# EAGLE design mapleCUx_large_340-007 (EAGLE 9.1.0)
MAPLE-CUx Large Version
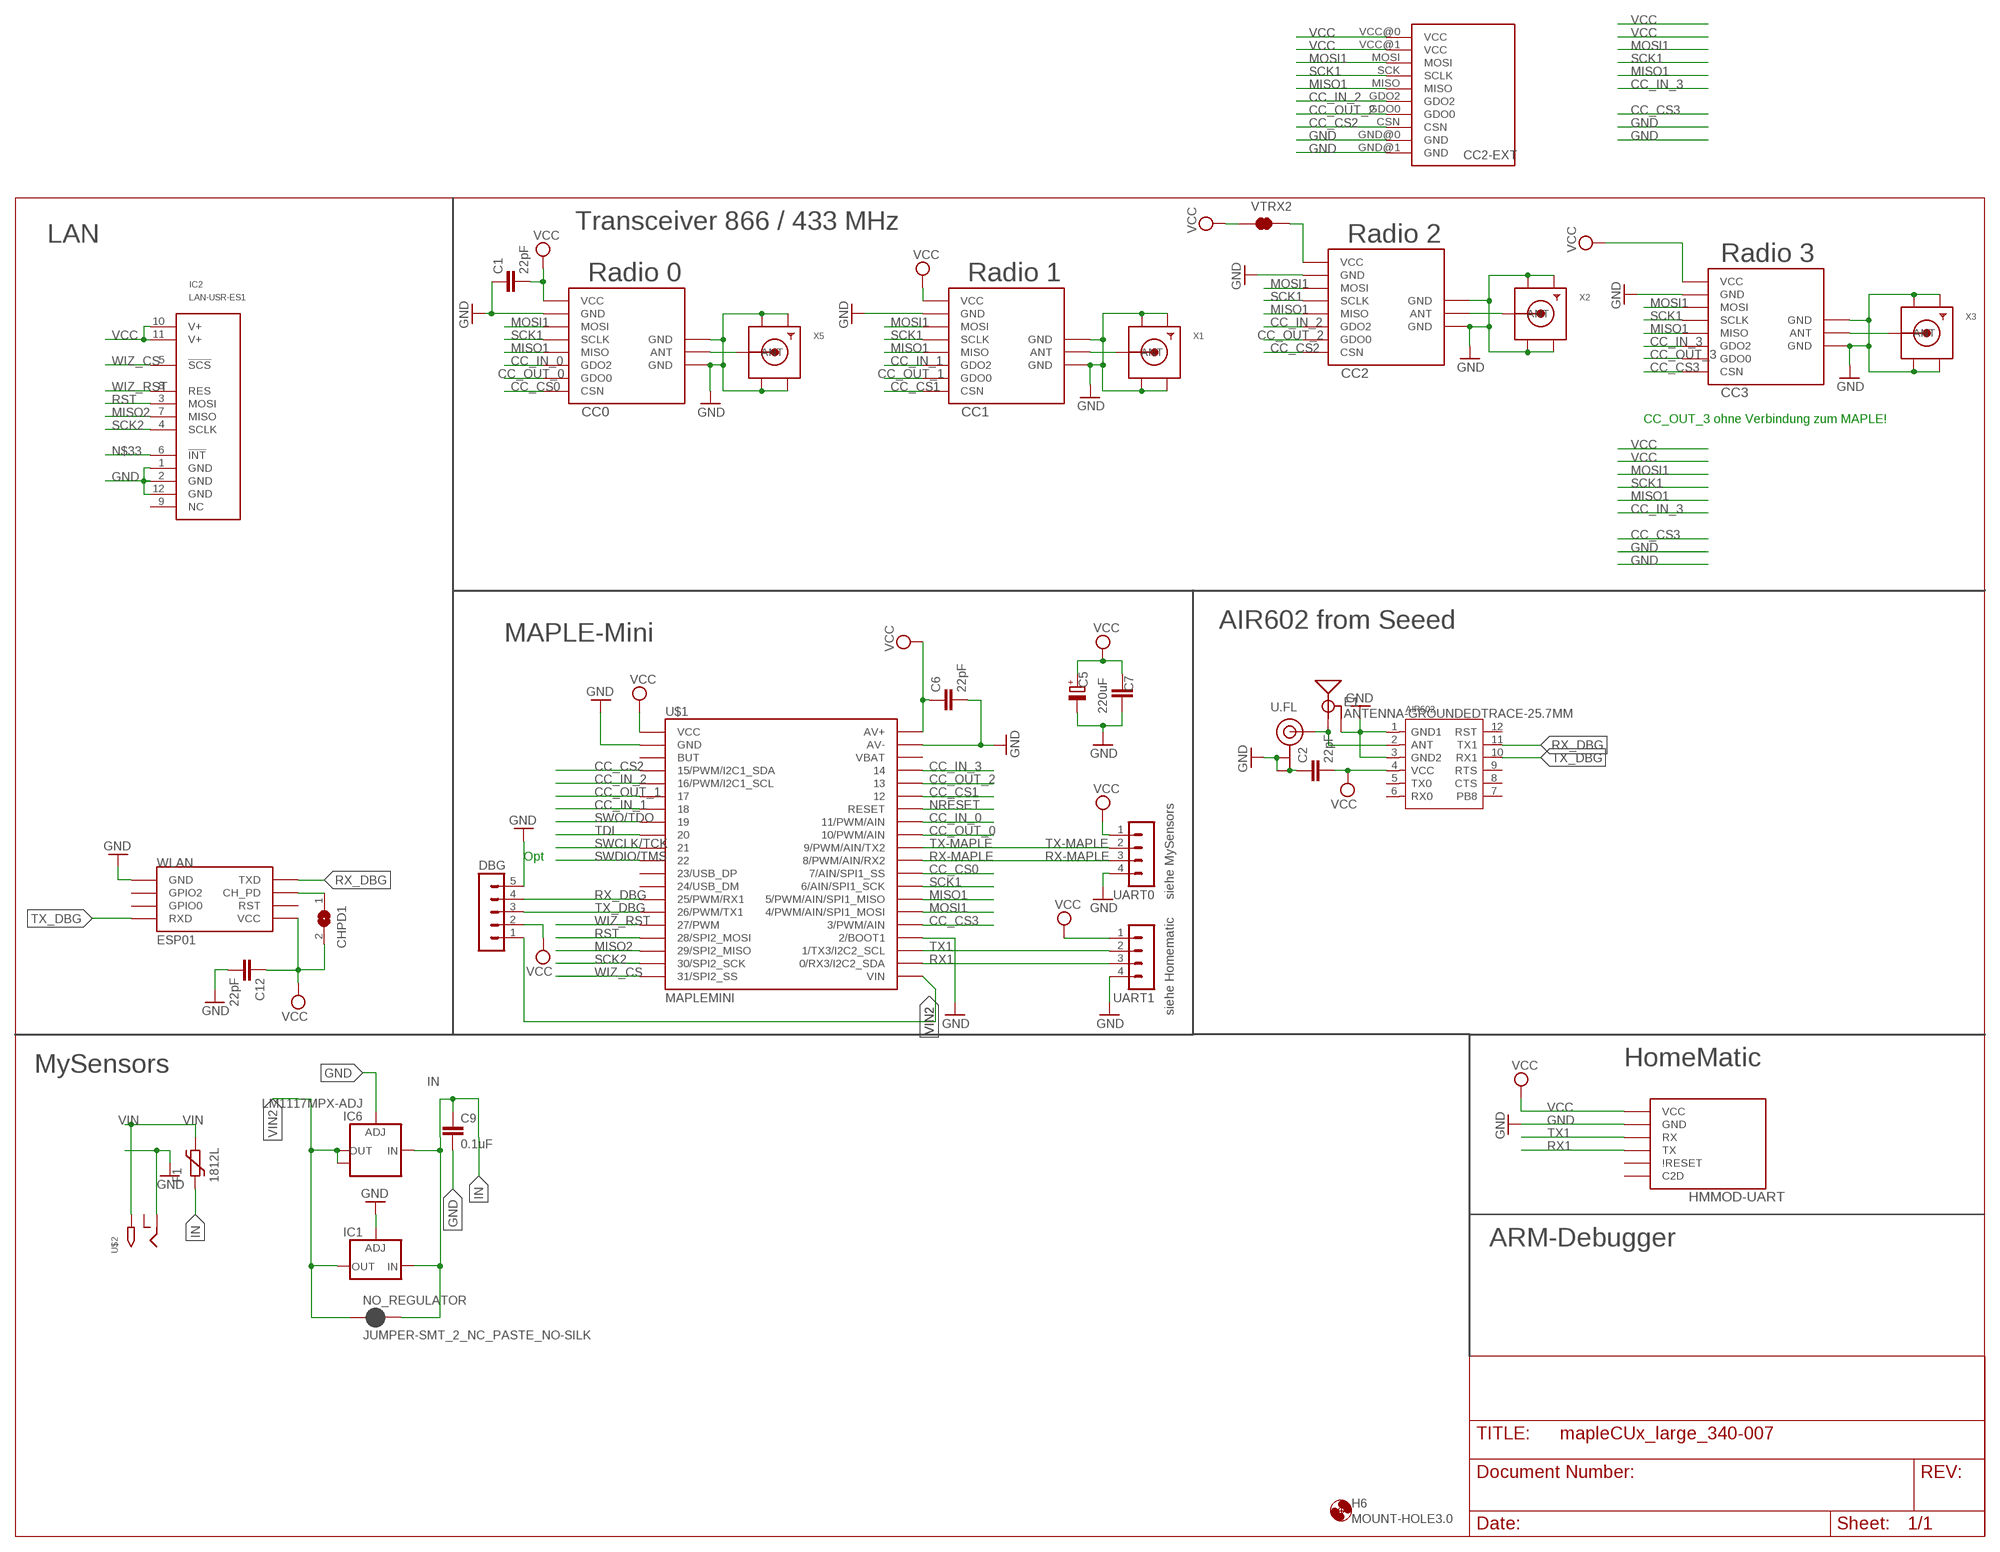
[diagram p0: schematic, sheet 1]

## Parts
AIR602  AIR602  [MODULE12P-2.0-10X12MM]
C1  22pF  C-EUC0805  [C0805]
C2  22pF  C-EUC0805  [C0805]
C5  220uF  CPOL-EUE5-8.5  [E5-8,5]
C6  22pF  C-EUC0805  [C0805]
C7  C-EUC1812  [C1812]
C9  0.1uF  C-EUC1206  [C1206]
C12  22pF  C-EUC0805  [C0805]
CC0  CC1101  CC1101_MODULE1SMD  [CC1101_MODULE1_SMD]
CC1  CC1101_MODULE1SMD  [CC1101_MODULE1_SMD]
CC2  CC1101_MODULE1SMD  [CC1101_MODULE1_SMD]
CC2-EXT  CC1101_MODULE3_DIL  [CC1101_MODULE3_DIL]
CC3  CC1101_MODULE1SMD  [CC1101_MODULE1_SMD]
CHPD1  SJ  [SJ]
DBG  MA05-1  [MA05-1]
E1  ANTENNA-GROUNDEDTRACE-25.7MM  [TRACE_ANTENNA_2.4GHZ_25.7MM]
F1  1812L  [1812L]
H6  MOUNT-HOLE3.0  [3,0]
HMMOD-UART  HM-MOD-UARTDIL  [HM-MOD-UART-DIL]
IC1  LD117ADT50TR  [DPACK]
IC2  LAN-USR-ES1  [USR-ES1]
IC6  LM1117MPX-ADJ  [SOT223]
NO_REGULATOR  JUMPER-SMT_2_NC_PASTE_NO-SILK  [SMT-JUMPER_2_NC_PASTE_NO-SILK]
U$1  MAPLEMINI  [20-DIP]
U$2  2.1MMJACKTHM  [PJ-102A]
U.FL  U.FL  [U.FL]
UART0  MA04-1  [MA04-1]
UART1  MA04-1  [MA04-1]
VTRX2  JUMPER-SMT_2_NC_TRACE_SILK  [SMT-JUMPER_2_NC_TRACE_SILK]
WLAN  ESP01  [ESP01]
X1  SMACONNECTOR_EDGE  [SMA_EDGELAUNCH]
X2  SMACONNECTOR_EDGE  [SMA_EDGELAUNCH]
X3  SMACONNECTOR_EDGE  [SMA_EDGELAUNCH]
X5  SMACONNECTOR_EDGE  [SMA_EDGELAUNCH]

## Nets
ANT0: CC0.ANT X5.P(ANT)
ANT1: CC1.ANT X1.P(ANT)
ANT2: CC2.ANT X2.P(ANT)
ANT3: CC3.ANT X3.P(ANT)
CC_CS0: CC0.CSN U$1.29(7/AIN/SPI1_SS)
CC_CS1: CC1.CSN U$1.35
CC_CS2: CC2-EXT.CSN CC2.CSN U$1.4(15/PWM/I2C1_SDA)
CC_CS3: CC3.CSN U$1.25(3/PWM/AIN)
CC_IN_0: CC0.GDO2 U$1.33(11/PWM/AIN)
CC_IN_1: CC1.GDO2 U$1.7
CC_IN_2: CC2-EXT.GDO2 CC2.GDO2 U$1.5(16/PWM/I2C1_SCL)
CC_IN_3: CC3.GDO2 U$1.37
CC_OUT_0: CC0.GDO0 U$1.32(10/PWM/AIN)
CC_OUT_1: CC1.GDO0 U$1.6
CC_OUT_2: CC2-EXT.GDO0 CC2.GDO0 U$1.36
CC_OUT_3: CC3.GDO0
GND [Power]: AIR602.1(GND1) AIR602.3(GND2) C1.1 C5.- C6.2 C7.1 C9.2 C12.2 CC0.GND@0(GND) CC0.GND@1(GND) CC0.GND@2(GND) CC1.GND@0(GND) CC1.GND@1(GND) CC1.GND@2(GND) CC2-EXT.GND@0(GND) CC2-EXT.GND@1(GND) CC2.GND@0(GND) CC2.GND@1(GND) CC2.GND@2(GND) CC3.GND@0(GND) CC3.GND@1(GND) CC3.GND@2(GND) DBG.5 E1.GND E1.GND2(GND) HMMOD-UART.2(GND) IC1.1(ADJ) IC2.1(GND) IC2.2(GND) IC2.12(GND) IC6.1(ADJ) U$1.2(GND) U$1.24(2/BOOT1) U$1.39(AV-) U$2.RING U.FL.1(GND) U.FL.2(GND) UART0.4 UART1.4 WLAN.GND X1.GND@1(GND4) X1.GND@2(GND3) X1.GND@3(GND2) X1.GND@4(GND1) X2.GND@1(GND4) X2.GND@2(GND3) X2.GND@3(GND2) X2.GND@4(GND1) X3.GND@1(GND4) X3.GND@2(GND3) X3.GND@3(GND2) X3.GND@4(GND1) X5.GND@1(GND4) X5.GND@2(GND3) X5.GND@3(GND2) X5.GND@4(GND1)
IN [Power]: C9.1 F1.P$1 IC1.3(IN) IC6.3(IN) NO_REGULATOR.2
MISO1: CC0.MISO CC1.MISO CC2-EXT.MISO CC2.MISO CC3.MISO U$1.27(5/PWM/AIN/SPI1_MISO)
MISO2: IC2.7(MISO) U$1.18(29/SPI2_MISO)
MOSI1: CC0.MOSI CC1.MOSI CC2-EXT.MOSI CC2.MOSI CC3.MOSI U$1.26(4/PWM/AIN/SPI1_MOSI)
N$1 [Power]: CC2.VCC VTRX2.2
N$2: CHPD1.1 WLAN.CH_PD
N$3: C2.1
N$4: AIR602.2(ANT) E1.ANT(SIGNAL) U.FL.FEED(SIGNAL)
N$33: IC2.6(!INT!)
NRESET: U$1.34(RESET)
RST: IC2.3(MOSI) U$1.17(28/SPI2_MOSI)
RX1: HMMOD-UART.5(TX) U$1.22(0/RX3/I2C2_SDA) UART1.3
RX-MAPLE: U$1.30(8/PWM/AIN/RX2) UART0.3
RX_DBG: AIR602.11(TX1) DBG.4 U$1.14(25/PWM/RX1) WLAN.TX(TXD)
SCK1: CC0.SCLK CC1.SCLK CC2-EXT.SCK(SCLK) CC2.SCLK CC3.SCLK U$1.28(6/AIN/SPI1_SCK)
SCK2: IC2.4(SCLK) U$1.19(30/SPI2_SCK)
SWCLK/TCK: U$1.10
SWDIO/TMS: U$1.11
SWO/TDO: U$1.8
TDI: U$1.9
TX1: HMMOD-UART.6(RX) U$1.23(1/TX3/I2C2_SCL) UART1.2
TX-MAPLE: U$1.31(9/PWM/AIN/TX2) UART0.2
TX_DBG: AIR602.10(RX1) DBG.3 U$1.15(26/PWM/TX1) WLAN.RX(RXD)
VCC [Power]: AIR602.4(VCC) C1.2 C2.2 C5.+ C6.1 C7.2 C12.1 CC0.VCC CC1.VCC CC2-EXT.VCC@0(VCC) CC2-EXT.VCC@1(VCC) CC3.VCC CHPD1.2 DBG.2 HMMOD-UART.1(VCC) IC2.10(V+) IC2.11(V+) U$1.1(VCC) U$1.40(AV+) UART0.1 UART1.1 VTRX2.1 WLAN.VCC
VIN [Power]: F1.P$2 U$2.TIP
VIN2 [Power]: DBG.1 IC1.4(OUT) IC6.2(OUT) IC6.TAB(OUT1) NO_REGULATOR.1 U$1.21(VIN)
WIZ_CS: IC2.5(!SCS!) U$1.20(31/SPI2_SS)
WIZ_RST: IC2.8(RES) U$1.16(27/PWM)
Unconnected: AIR602.5(TX0) AIR602.6(RX0) AIR602.7(PB8) AIR602.8(CTS) AIR602.9(RTS) AIR602.12(RST) HMMOD-UART.3(C2D) HMMOD-UART.4(\!RESET) IC2.9(NC) U$1.3(BUT) U$1.12(23/USB_DP) U$1.13(24/USB_DM) U$1.38(VBAT) U$2.RING_SW WLAN.GPIO0 WLAN.GPIO2 WLAN.RST

## Notes on the sheet
- Transceiver 866 / 433 MHz
- LAN | Radio 2
- Radio 3
- Radio 0 | Radio 1
- CC_OUT_3 ohne Verbindung zum MAPLE!
- AIR602 from Seeed
- MAPLE-Mini
- Opt
- siehe MySensors
- siehe Homematic
- MySensors | HomeMatic
- ARM-Debugger

## Library data of the parts
AIR602 = AIR602:AIR602
C1 C2 C6 C7 C9 C12 = rcl:C-EU: CAPACITOR, European symbol
C5 = rcl:CPOL-EU: POLARIZED CAPACITOR, European symbol
CC0 CC1-CC3 = wireless:CC1101_MODULE1: CC1101 wireless module for 433/868 MHz (sold from Aliexpress). DIL version for mounting with pin header (and SMD soldering) and SMD only variant available.
CC2-EXT = wireless:CC1101_MODULE3_DIL: 433 Mhz CC1101 wireless module named RF1101SE V3.1 package special has only limited silk screen on tPlace layer
CHPD1 = jumper:SJ: SMD solder JUMPER
DBG = con-lstb:MA05-1: PIN HEADER; OC_FARNELL: unknown; OC_NEWARK: unknown
E1 = SparkFun-RF:ANTENNA-GROUNDED: Antenna w/ Ground Connection 2.4GHz antennae with signal and ground terminals. TRACE_ANTENNA_2.4GHZ_15.2MM - Meander Trace antenna 15.2 x 5.7mm footprint Based on layout from TI app note AN043 <http://www.ti.com/lit/an/swra117d/swra117d.pdf>. TRACE_ANTENNA_2.4GHZ_25.7MM - Inverted F trace antenna 25.7 x 7.5 mm footprint. Based on layout from TI design note DN0007 <http://www.ti.com/lit/an/swru120b/swru120b.pdf>.
F1 = ptc-littlefuse:1812L
H6 = holes:MOUNT-HOLE: MOUNTING HOLE with drill center marker
HMMOD-UART = wireless:HM-MOD-UART: eQ3 HM-MOD-UART-AW-SH2 wireless module for 868 MHz. DIL version for mounting with pin header (antenna upwards) and SMD variant available (antenna downwards).
IC1 = v-reg:LD117A?*: Low drop fixed and adjustable positive voltage regulators 1 A Source: http://www.st.com/stonline/products/literature/ds/7194/ld1117axx.pdf
IC2 = Martin-Communication:LAN-USR-ES1
IC6 = lm1117:LM1117MPX-ADJ
NO_REGULATOR = SparkFun-Jumpers:JUMPER-SMT_2_NC_PASTE: Normally closed solder jumper This jumper has an aperture in the stencil to allow solder paste to bridge the split in the wire so it's normally closed (NC). Wick off the solder to open the connection. Reapply solder to reclose the connection.
U$1 = maplemini-small:MAPLEMINI
U$2 = adafruit:2.1MMJACK: 2.1mm x 5.5mm THM DC jack with internal switch. Digikey part #PJ-102A, 4UCON part #05537 2.1mm x 5.5mm SMT DC jack with internal switch. Digikey part #PJ-002A-SMT, 4UCON part #03267 By microbuilder.eu & adafruit.com
U.FL = SparkFun-Connectors:U.FL: SMD Antenna Connector - U.FL 2mm height, 3.0mm x 3.0mm receptacle size. SparkFun Products: SparkFun WiFi Shield - ESP8266 <https://www.sparkfun.com/products/13287> SparkFun ESP8266 Thing <https://www.sparkfun.com/products/13231> SparkFun MiniGen - Pro Mini Signal Generator Shield <https://www.sparkfun.com/products/11420>; PROD_ID: CONN-09193; SF_ID: WRL-09144
UART0 UART1 = con-lstb:MA04-1: PIN HEADER; OC_FARNELL: unknown; OC_NEWARK: unknown
VTRX2 = SparkFun-Jumpers:JUMPER-SMT_2_NC_TRACE: Normally closed trace jumper This jumper has a trace between two pads so it's normally closed (NC). Use a razor knife to open the connection. For best results follow the IPC guidelines for cutting traces: Cutout at least 0.063 mm (0.005 in). Remove all loose material to clean up the cut area. Seal the cut with an approved epoxy. Reapply solder to reclose the connection.
WLAN = esp8266modules:ESP01: ESP8266 Wifi module 01
X1-X3 X5 = adafruit:SMACONNECTOR: SMA Connector 90° DIP SMA Connector, 50 Ohm (4UConnector: 07259)

## Net classes
0 default: width 0.305 mm
1 Power: width 0.61 mm

## Board
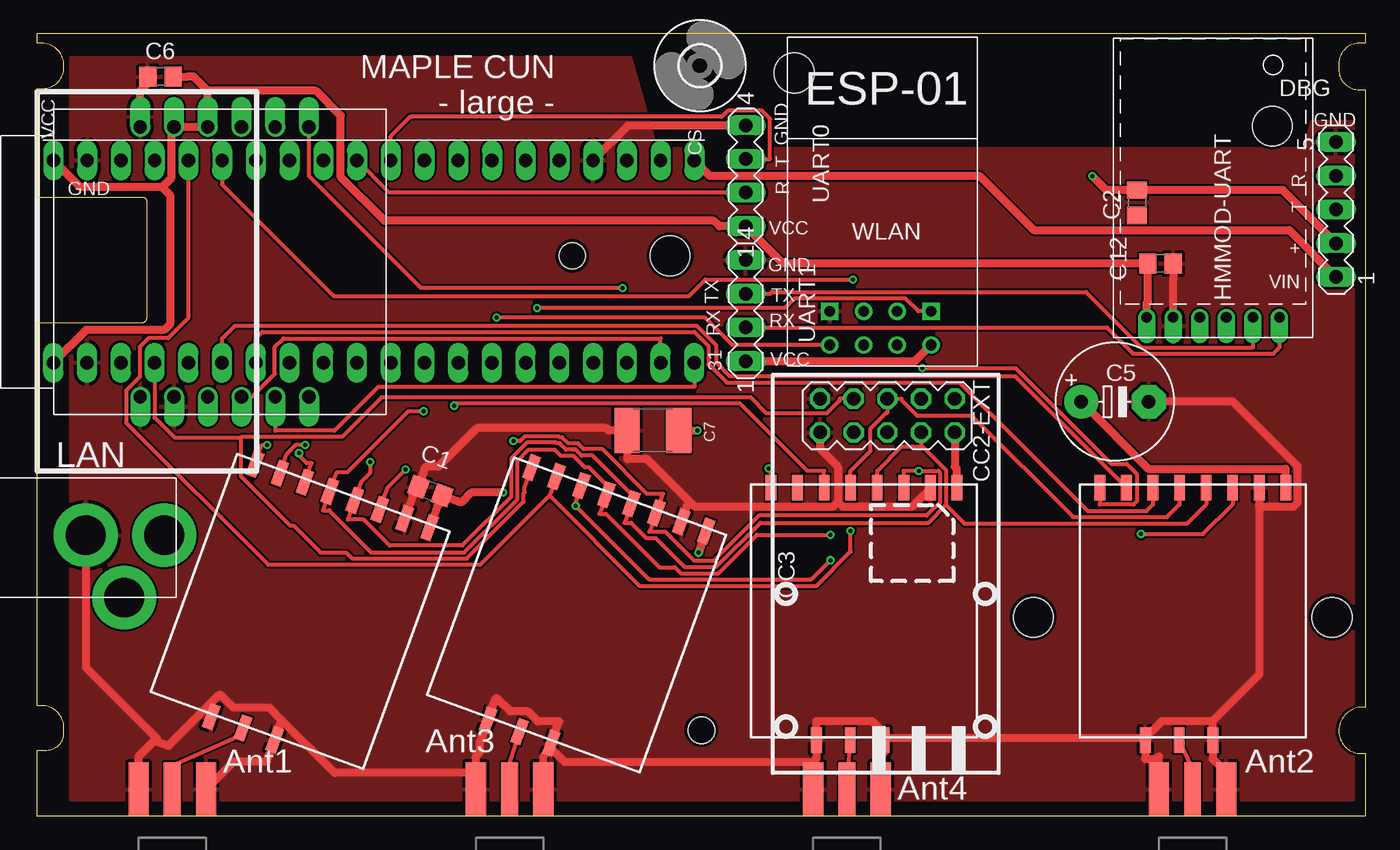
[diagram p1: board, top side]
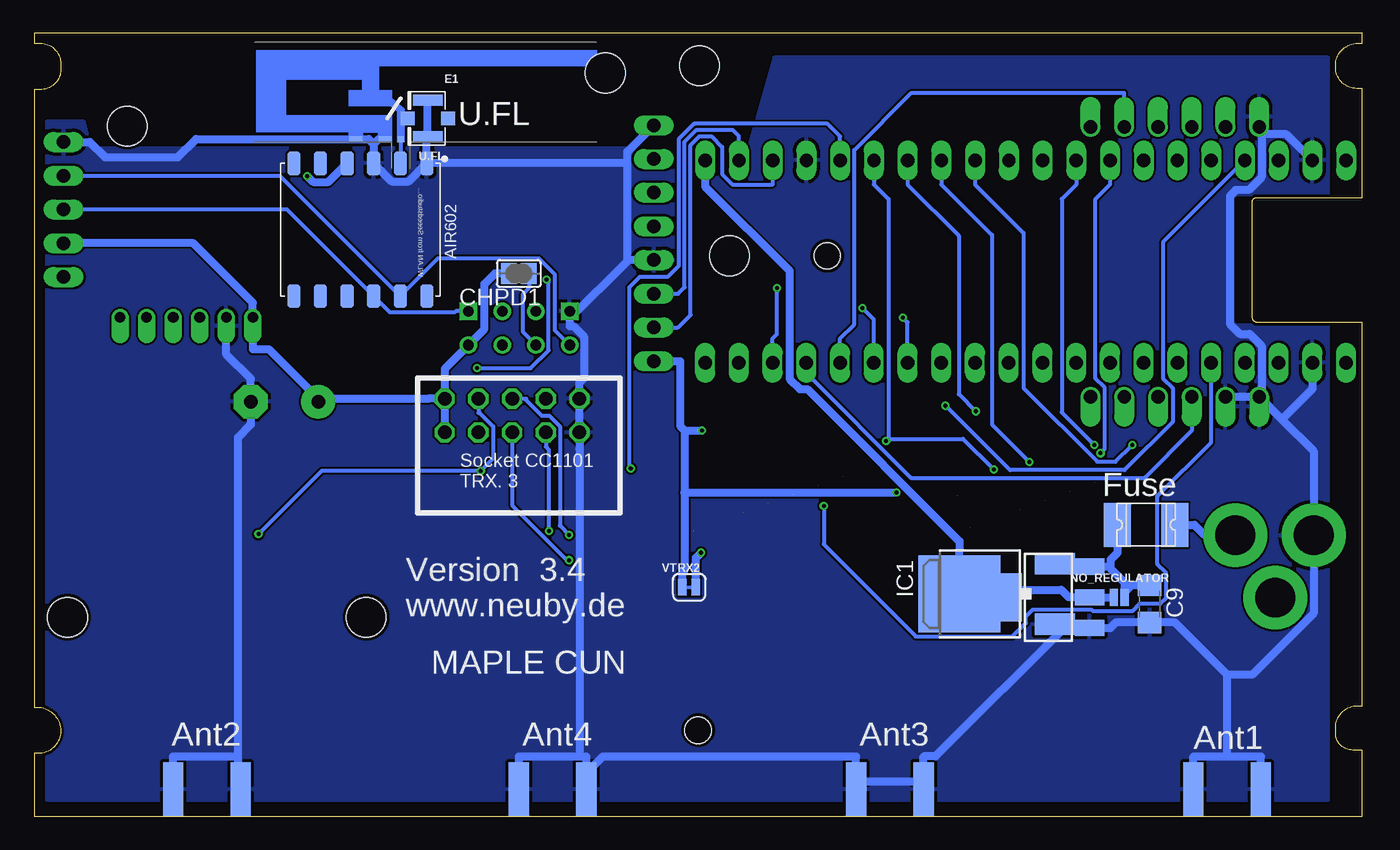
[diagram p2: board, bottom side, seen from below]

Size 100 x 59 mm. Coordinates in mm from the lower left corner, seen from the top.
Outline: 0,0 0,5 0.71,5 arc90 2,6.29 2,6.67 arc90 0.32,8.35 0,8.35 0,37.21 7.89,37.21 arc90 8.26,37.58 8.26,46.32 arc90 7.97,46.61 0,46.61 0,54.83 0.39,54.83 arc90 2,56.44 2,56.57 arc90 0.33,58.24 0,58.24 0,59 100,59 100,58.24 99.54,58.24 arc90 98,56.7 98,56.41 arc90 99.41,54.75 100,54.75 100,8.24 99.8,8.24 arc90 98,6.44 arc90 99.69,4.75 100,4.75 100,0 0,0
Copper layers (1*16): Top 0.035mm / dielectric 1.5mm / Bottom 0.035mm
Design rules "SeeedStudio_2layer_DRU_no_angle_20140221": minimum track width 6mil, minimum drill 12mil, track to track 6mil, track to pad 6mil, pad to pad 6mil, via to via 6mil, smd to smd 0mil, copper to edge 10mil, drill to drill 10mil, minimum pad ring 10mil, minimum via ring 6mil, stop-mask expansion 2mil, vias tented up to drill 100mil, thermal gap 10mil
Holes 2 mm at 50,6.5 40.28,42.23
Holes 3 mm at 47.65,42.23 93,52 57,56 75,15 97.5,15
tRestrict: area 0,37.3 to 9.4,46.5
bRestrict: area 0,37.3 to 9.4,46.5

### Footprints (pad centres in the part's own frame; a part is rotated, then mirrored left to right if it is on the bottom)
MODULE12P-2.0-10X12MM = smd 1.8 x 1: 1 -5,5; 2 -5,3; 3 -5,1; 4 -5,-1; 5 -5,-3; 6 -5,-5; 7 5,-5; 8 5,-3; 9 5,-1; 10 5,1; 11 5,3; 12 5,5
C0805 = smd 1.3 x 1.5: 1 -0.95,0; 2 0.95,0
E5-8,5 = drill 1.016 pad 2.54: + -2.54,0 | drill 1.016 pad 2.54 octagon: - 2.54,0
C1812 = smd 1.9 x 3.4: 1 -1.95,0; 2 1.95,0
C1206 = smd 1.6 x 1.8: 1 -1.4,0; 2 1.4,0
CC1101_MODULE1_SMD = smd 1.93 x 0.813: ANT 19,5.96; CSN 0,0; GDO0 0,2; GDO2 0,4; GND@0 0,12; GND@1 19,8.5; GND@2 19,3.42; MISO 0,6; MOSI 0,10; SCLK 0,8; VCC 0,14
CC1101_MODULE3_DIL = drill 1.016 octagon: CSN 1.81,6.1; GDO0 4.35,6.1; GDO2 4.35,8.64; GND@0 1.81,3.56; GND@1 4.35,3.56; MISO 1.81,8.64; MOSI 1.81,11.18; SCK 4.35,11.18; VCC@0 1.81,13.72; VCC@1 4.35,13.72
SJ = smd 1.168 x 1.6: 1 -0.762,0; 2 0.762,0
MA05-1 = drill 1.016 long: 1 -5.08,0; 2 -2.54,0; 3 0,0; 4 2.54,0; 5 5.08,0
TRACE_ANTENNA_2.4GHZ_25.7MM = smd 0.46 x 0.46: ANT 0,0.23 | smd 1 x 0.46: GND -1.18,0.23; GND2 -3.38,0.23
1812L = smd 2.03 x 3.3: P$1 -2.16,0; P$2 2.16,0
3,0 = hole 3: 0,0
HM-MOD-UART-DIL = drill 0.8 offset: 1 0,12; 2 0,10; 3 0,8; 4 0,6; 5 0,4; 6 0,2
DPACK = smd 1.6 x 3: 1 -2.28,-4.8; 3 2.28,-4.8 | smd 5.8 x 6.2: 4 0,2.38
USR-ES1 = drill 1 pad 1.35 offset: 1 -10.16,5.715; 2 -10.16,3.175; 3 -10.16,0.635; 4 -10.16,-1.905; 5 -10.16,-4.445; 6 -10.16,-6.985; 7 10.16,-6.985; 8 10.16,-4.445; 9 10.16,-1.905; 10 10.16,0.635; 11 10.16,3.175; 12 10.16,5.715
SOT223 = smd 1.219 x 2.235: 1 -2.311,-3.099; 2 0,-3.099; 3 2.311,-3.099 | smd 3.6 x 2.2: TAB 0,3.099
SMT-JUMPER_2_NC_PASTE_NO-SILK = smd 0.635 x 1.27: 1 -0.406,0; 2 0.406,0
20-DIP = drill 1.016 pad 1.27 long: 1 -24.13,-7.62; 2 -21.59,-7.62; 3 -19.05,-7.62; 4 -16.51,-7.62; 5 -13.97,-7.62; 6 -11.43,-7.62; 7 -8.89,-7.62; 8 -6.35,-7.62; 9 -3.81,-7.62; 10 -1.27,-7.62; 11 1.27,-7.62; 12 3.81,-7.62; 13 6.35,-7.62; 14 8.89,-7.62; 15 11.43,-7.62; 16 13.97,-7.62; 17 16.51,-7.62; 18 19.05,-7.62; 19 21.59,-7.62; 20 24.13,-7.62 | drill 1 pad 1.27 long: 21 24.13,7.62; 22 21.59,7.62; 23 19.05,7.62; 24 16.51,7.62; 25 13.97,7.62; 26 11.43,7.62; 27 8.89,7.62; 28 6.35,7.62; 29 3.81,7.62; 30 1.27,7.62; 31 -1.27,7.62; 32 -3.81,7.62; 33 -6.35,7.62; 34 -8.89,7.62; 35 -11.43,7.62; 36 -13.97,7.62; 37 -16.51,7.62; 38 -19.05,7.62; 39 -21.59,7.62; 40 -24.13,7.62
PJ-102A = drill 3 pad 4.8: RING 0.1,-3.39; RING_SW -4.6,-6.29; TIP 0.1,-9.29
U.FL = smd 2.2 x 0.85: 1 0,1.375; 2 0,-1.375 | smd 1.05 x 1: FEED 1.525,0; NC -1.525,0
MA04-1 = drill 1.016 long: 1 -3.81,0; 2 -1.27,0; 3 1.27,0; 4 3.81,0
SMT-JUMPER_2_NC_TRACE_SILK = smd 0.635 x 1.27: 1 -0.508,0; 2 0.508,0
ESP01 = drill 0.8: CH_PD -1.285,-8.178; GPIO0 1.255,-5.638; GPIO2 -1.285,-5.638; RST 1.255,-8.178; TX -3.825,-8.178; VCC 3.795,-8.178 | drill 0.8 square: GND -3.825,-5.638; RX 3.795,-5.638
SMA_EDGELAUNCH = smd 4.064 x 1.524: GND@1 2.032,-2.54; GND@2 2.032,2.54 | smd 4.064 x 1.524 bottom: GND@3 2.032,2.54; GND@4 2.032,-2.54 | smd 4.064 x 1.27: P 2.032,0

### Placement (x,y rotation side)
AIR602  75.44,44.2 270 bottom
C1  29.59,24.51 340 top
C2  82.8,46.23 90 top
C5  81.15,31.24 0 top
C6  9.27,55.74 180 top
C7  46.35,29.08 0 top
C9  16,16 270 bottom
C12  84.58,41.66 0 top
CC0  16.38,26.54 250 top
CC1  80.01,24.77 270 top
CC2  37.21,26.29 250 top
CC2-EXT  55.37,33.27 270 top
CC3  55.24,24.77 270 top
CHPD1  63.5,40.89 180 bottom
DBG  97.79,45.72 90 top
E1  72.39,50.8 0 bottom
F1  16.26,21.97 0 bottom
H6  49.89,56.55 0 top
HMMOD-UART  95.54,37.59 90 top
IC1  27.94,16.76 90 bottom
IC2  13.46,41.78 90 top
IC6  23.62,16.51 90 bottom
NO_REGULATOR  18.29,16.51 0 bottom
U$1  25.34,41.8 0 top
U$2  0.25,21.08 90 top
U.FL  70.36,52.58 180 bottom
UART0  53.34,48.26 90 top
UART1  53.34,38.1 90 top
VTRX2  50.67,17.27 0 bottom
WLAN  63.5,43.69 0 top
X1  87,0 90 top
X2  35.56,0 90 top
X3  60.96,0 90 top
X5  10.16,0 90 top

### Tracks (layer width: path | path; a pad name or v marks a point on that pad's centre or on a via)
ANT0
  Top 0.305: CC0.ANT 14.73,5.84 10.16,3.81 X5.P
ANT1
  Top 0.305: CC1.ANT 86.87,3.81 X1.P
ANT2
  Top 0.305: CC2.ANT 35.31,3.3 X2.P
ANT3
  Top 0.305: CC3.ANT 60.96,2.54 X3.P
CC_CS0  (via drill 0.3 pad 0.61)
  Top 0.305: v17.3,27.99 v17.29,27.98 16.91,27.98 CC0.CSN
  Bottom 0.305: v17.3,27.99 18.56,26.73 19.94,26.73 25.5,32.29 25.5,43.96 29.15,47.61 U$1.29
CC_CS1  (via drill 0.3 pad 0.61)
  Top 0.305: v66.65,33.76 73.66,33.76 80.87,26.56 82.04,26.56 82.78,25.82 82.78,23.73 82.55,23.5 80.01,23.5 CC1.CSN | U$1.35 13.91,47.61 22.31,39.2 49.06,39.2 50.31,40.45 v61.43,40.45
  Bottom 0.305: v66.65,33.76 62.61,33.76 61.26,35.11 61.26,40.28 v61.43,40.45
CC_CS2
  Top 0.305: 15.32,28.53 15.32,25.63 19.05,21.91 19.29,21.91 21.31,19.89 23.25,19.89 23.7,19.43 32.33,19.43 36.62,23.72 36.62,24.37 36.69,24.44 36.69,24.85 | 36.69,24.85 | 15.32,28.53 15.4,28.6 17.56,28.6 17.57,28.59 22.93,28.59 25.91,31.56 53.72,31.56 54.92,30.36 59.44,30.36 60.41,31.33 60.41,31.46 CC2-EXT.CSN | U$1.4 8.83,30.04 10.34,28.53 15.32,28.53 | CC2.CSN 36.69,24.85
CC_CS3  (via drill 0.3 pad 0.61)
  Top 0.305: v55.07,26.21 55.24,26.04 CC3.CSN
  Bottom 0.305: v55.07,26.21 55.2,26.34 55.2,39.84 54.4,40.64 52.31,40.64 51.48,41.47 51.48,51 50.3,52.18 40.25,52.18 39.31,51.23 U$1.25
CC_IN_0  (via drill 0.3 pad 0.61)  (1 unrouted)
  Top 0.305: v19.7,27.36 19.7,27.21 19.75,27.15 20.29,26.61 20.66,26.61 CC0.GDO2
  Bottom 0.305: v19.7,27.36 19.39,27.67 19.39,32.31 20.08,33 20.08,46.52 18.99,47.61 U$1.33
CC_IN_1
  Top 0.305: CC1.GDO2 84.01,23.5 83.52,23.01 79.12,23.01 69.45,32.68 51.93,32.68 50.53,34.08 50.53,35.44 49.48,36.49 16.93,36.49 16.45,36.01 U$1.7
CC_IN_2  (via drill 0.3 pad 0.61)  (1 unrouted)
  Top 0.305: v59.72,19.3 58.27,17.86 46.07,17.86 v40.54,23.39 40.45,23.48 | 40.45,23.48 | CC2.GDO2 40.45,23.48
  Bottom 0.305: v59.72,19.3 59.88,19.3 64.01,23.43 64.01,27.86 CC2-EXT.GDO2 | v40.54,23.39 40.54,20.5 33.6,13.56 26.33,13.56 25.32,14.57 25.32,15.08 24.81,15.59 20.4,15.59 20.31,15.5 17.25,15.5 16.72,16.03 15.18,16.03 14.75,16.45 14.75,18.34 15.42,19 15.42,24.12 11.37,28.17 U$1.5
CC_IN_3  (via drill 0.3 pad 0.61)
  Top 0.305: v31.38,30.94 31.53,31.09 52.92,31.09 57.98,26.04 59.24,26.04 CC3.GDO2
  Bottom 0.305: U$1.37 15,43.25 15,33 14.26,32.26 14.26,29.72 17.9,26.08 26.52,26.08 v31.38,30.94
CC_OUT_0  (via drill 0.3 pad 0.61)  (1 unrouted)
  Top 0.305: v20.16,27.98 v20.16,27.97 19.44,27.97 19.09,27.61 19.09,27.6 18.79,27.3 | 18.79,27.3 | CC0.GDO0 18.79,27.3
  Bottom 0.305: v20.16,27.98 22.62,30.44 22.62,46.51 21.53,47.61 U$1.32
CC_OUT_1
  Top 0.305: CC1.GDO0 73.64,33.14 52.17,33.14 51.13,34.18 51.13,35.49 49.67,36.95 14.85,36.95 13.91,36.01 U$1.6
CC_OUT_2  (via drill 0.3 pad 0.61)  (1 unrouted)
  Top 0.305: U$1.36 11.37,37.55 9.85,36.03 8.38,36.03 7.72,35.37 7.72,33.11 6.68,32.07 6.68,29.65 17.36,18.97 33.37,18.97 38.57,24.17 | 38.57,24.17 | 38.57,24.17 45.36,17.38 58.66,17.38 61.23,19.95 v61.23,21.52 | CC2.GDO0 38.57,24.17
  Bottom 0.305: CC2-EXT.GDO0 61.47,27.86 61.23,27.62 v61.23,21.52
GND
  Top 0.61: 49.06,23.77 45.91,26.93 44.41,26.93 C7.1 43,29.08 42.82,29.26 33.12,29.26 30.21,26.35 29.25,26.35 C1.1 28.25,24.39 28.25,24.07 | 49.06,23.77 49.49,23.34 59.92,23.34 60.28,23.71 | CC2.GND@0 49.06,23.77 | 60.28,23.71 60.65,23.34 65.89,23.34 67.25,24.69 CC3.GND@0 | 60.28,23.71 60.28,26.35 58.93,27.7 CC2-EXT.GND@1 | X1.GND@3 84.45,4.52 84.28,4.34 83.43,4.34 CC1.GND@2 83.43,5.84 83.43,5.88 83.43,5.91 | 38.7,5.12 CC2.GND@1 39.29,7.16 37.69,7.16 36.94,7.91 35.62,7.91 34.63,8.9 34.52,8.9 CC2.GND@2 33.33,5.63 | 58.42,4.1 58.66,4.34 CC3.GND@2 58.66,7.19 62.83,7.19 63.74,6.27 | X3.GND@3 58.42,4.1 | 58.42,4.1 39.72,4.1 38.7,5.12 | 38.7,5.12 38.1,4.52 X2.GND@1 | 28.25,24.07 | IC2.12 7.75,54.66 8.32,55.24 C6.2 | C12.2 85.53,40.45 85.54,40.45 HMMOD-UART.2 | 92.01,23.34 94.61,23.34 94.91,23.64 94.91,26.37 90.03,31.24 C5.- | 92.01,23.34 92.01,23.53 CC1.GND@0 | 92.01,23.34 92.01,10.69 88.51,7.19 | 88.51,7.19 CC1.GND@1 88.51,4.34 89.53,3.32 X1.GND@4 | 83.43,5.91 84.7,7.19 88.51,7.19 | 63.74,6.27 64.1,5.91 83.43,5.91 | 63.74,6.27 CC3.GND@1 63.74,5.05 63.74,4.77 63.5,4.52 X3.GND@4 | 18.41,7.25 17.47,8.19 14.77,8.19 13.81,9.15 13.69,9.15 9.85,5.31 8.8,5.7 7.62,4.52 X5.GND@3 | 33.02,3.28 22.38,3.28 18.41,7.25 | 33.02,3.28 33.02,4.52 33.33,4.83 33.33,5.63 | X2.GND@3 33.02,3.28 | 33.33,5.63 | X5.GND@4 14.82,4.15 17.28,4.15 CC0.GND@1 18.41,7.25 | U$2.RING 3.64,11.23 8.99,5.89 | CC0.GND@0 28.25,24.07 | U$1.24 44.5,52.07 UART0.4
  Bottom 0.61: HMMOD-UART.2 85.54,34.81 83.69,32.97 C5.- 83.69,30.38 83.69,29.52 84.65,28.56 84.65,4.52 | 58.93,4.52 58.42,4.52 58.42,3.28 | 58.93,4.52 63.5,4.52 X3.GND@4 | 58.93,4.52 58.93,27.7 CC2-EXT.GND@1 CC2-EXT.GND@0 58.93,32.68 58.56,33.05 58.56,36.11 59.4,36.94 59.67,36.94 59.67,37.49 | 55.32,49.2 55.32,50.09 UART0.4 | 55.32,41.91 55.32,49.2 | 55.32,49.2 AIR602.1 | 55.32,41.91 55.13,41.91 UART1.4 | 59.67,37.49 55.32,41.85 55.32,41.91 | WLAN.GND 59.67,37.49 | 74.43,50.65 74.44,50.64 AIR602.3 73.07,47.83 71.81,47.83 AIR602.1 | 74.43,50.65 74.05,51.03 E1.GND | 74.43,50.65 74.81,51.03 E1.GND2 87.8,51.03 89.19,49.65 94.65,49.65 95.81,50.8 DBG.5 | U.FL.2 U.FL.1 70.44,51.12 AIR602.1 | 38.1,2.65 38.1,4.52 57.17,4.52 58.42,3.28 | X2.GND@1 38.1,2.65 | X3.GND@3 58.42,3.28 | 10.16,10.67 14.09,14.6 C9.2 18.55,14.6 18.95,14.2 IC6.1 20.9,14.2 21.18,14.48 22.16,14.48 | 10.16,4.52 10.16,10.67 | 10.16,10.67 8.27,10.67 3.64,15.3 U$2.RING 3.64,27.52 6.03,29.91 | 10.16,4.52 7.62,4.52 X5.GND@3 | 10.16,4.52 12.7,4.52 X5.GND@4 | 33.02,2.65 33.02,4.52 32.12,4.52 22.16,14.48 | X2.GND@3 33.02,2.65 | 38.1,2.65 33.02,2.65 | IC1.1 22.16,14.48 | 7.56,51.39 7.56,48.16 8.54,47.18 9.52,47.18 9.96,46.74 9.96,37.1 9.21,36.34 8.46,36.34 7.56,35.44 7.56,31.81 IC2.1 | IC2.12 7.56,51.76 7.56,51.39 | U$1.39 5.72,51.39 7.56,51.39 | IC2.2 IC2.1 | 6.03,29.91 IC2.1 | 6.03,29.91 3.75,32.2 U$1.2 | 84.65,4.52 84.65,3.47 84.45,3.28 X1.GND@3 | 84.65,4.52 89.53,4.52 X1.GND@4
  pour Top: 2.54,57.15 44.63,57.15 46.59,50.29 95.5,50.29 96.01,52.32 99.06,52.32 99.06,1.27 2.54,1.27
  pour Bottom: 2.54,1.27 2.54,57.15 44.27,57.15 46.23,50.29 95.76,50.29 96.27,52.32 99.06,52.32 99.06,1.27
IN
  Bottom 0.61: C9.1 17.36,17.4 17.7,17.06 17.88,17.06 | 17.88,17.06 17.88,17.6 18.95,18.67 18.95,18.82 | NO_REGULATOR.2 17.88,17.06 | F1.P$1 18.42,19.86 18.95,19.33 18.95,18.82 | 18.95,18.82 IC6.3 20.75,19.04 21.18,19.04 IC1.3
MISO1  (via drill 0.3 pad 0.61)  (2 unrouted)
  Top 0.305: v29.08,30.52 27.92,30.52 23.33,25.93 22.54,25.93 CC0.MISO 21.5,23.05 21.97,23.05 25.14,19.89 32.14,19.89 36.14,23.89 36.14,26.79 37,27.64 38.95,27.64 39.41,27.18 40.34,27.18 41.2,26.32 41.5,26.32 42.85,24.97 CC2.MISO 42.33,22.8 42.81,22.8 46.83,18.77 48,18.77 48.45,18.32 51.28,18.32 54.18,21.22 v59.71,21.22 | CC3.MISO 61.24,26.04 62.74,27.53 62.74,29.24 63.9,30.4 64.01,30.4 CC2-EXT.MISO 65.08,31.46 65.08,31.35 66.24,30.19 70.36,30.19 78,22.55 85.07,22.55 86.01,23.5 CC1.MISO
  Bottom 0.305: U$1.27 34.23,47.61 30.37,43.75 30.37,31.81 v29.08,30.52 | v59.71,21.22 60.41,21.91 60.41,29.38 61.22,30.19 61.79,30.19 62.95,31.35 62.95,31.46 CC2-EXT.MISO
MISO2  (via drill 0.3 pad 0.61)
  Top 0.305: v44.07,39.81 28.88,39.81 20.45,48.24 IC2.7
  Bottom 0.305: v44.07,39.81 44.07,36.33 44.39,36.01 U$1.18
MOSI1  (via drill 0.3 pad 0.61)  (2 unrouted)
  Top 0.305: CC0.MOSI 26.3,24.56 | v27.73,26.13 26.3,24.7 26.3,24.56 | 26.3,24.56 | 40.53,28.1 40.72,28.1 41.15,27.67 42.55,27.67 45.92,24.31 47.13,24.31 CC2.MOSI 46.09,21.43 47.3,21.43 49.47,19.26 50.93,19.26 54.33,22.67 66.95,22.67 67.96,23.67 67.96,25.92 67.84,26.04 v66.37,26.04 | 40.53,28.1 | 40.53,28.1 39.98,28.1 39.53,28.55 39.34,28.55 39.27,28.62 36.68,28.62 36.34,28.28 v35.84,28.28 | CC1.MOSI 90.01,23.5 87.78,21.27 v83.11,21.27 | v66.37,26.04 65.25,26.04 CC3.MOSI | v66.37,26.04
  Bottom 0.305: 35.67,28.45 v35.84,28.28 | 35.67,28.45 35.67,46.51 36.77,47.61 U$1.26 | 35.67,28.45 30.05,28.45 v27.73,26.13 | v83.11,21.27 78.34,26.04 v66.37,26.04 65.43,26.98 65.43,29.38 66.44,30.4 66.55,30.4 CC2-EXT.MOSI
N$1  (via drill 0.3 pad 0.61)  (1 unrouted)
  Top 0.61: v49.77,19.87 | CC2.VCC v49.77,19.87
  Bottom 0.61: VTRX2.2 50.16,19.48 v49.77,19.87
N$2
  Bottom 0.305: CHPD1.1 62.74,39.79 63.18,39.35 63.18,36.48 WLAN.CH_PD
N$4
  Bottom 0.305: AIR602.2 72.39,49.24 E1.ANT 72.39,52.07 U.FL.FEED
RST
  Bottom 0.305: IC2.3 12.83,29.06 16.38,25.5 33.97,25.5 41.85,33.39 U$1.17
RX1
  Top 0.305: HMMOD-UART.5 91.54,35.33 83.14,35.33 78.96,39.5 55.3,39.5 55.17,39.37 UART1.3
  Bottom 0.305: U$1.22 46.93,51.23 47.42,51.72 50.11,51.72 51.02,50.81 51.02,39.86 51.51,39.37 UART1.3
RX-MAPLE
  Top 0.305: U$1.30 26.61,51.23 28.08,52.7 51.55,52.7 52,53.15 54.57,53.15 55.17,52.55 55.17,49.53 UART0.3
RX_DBG  (via drill 0.3 pad 0.61)
  Top 0.305: WLAN.TX 52.34,35.51 50.28,37.57 v34.58,37.57
  Bottom 0.305: U$1.14 34.23,37.22 v34.58,37.57 | DBG.4 81.5,48.26 AIR602.11 69.61,42.03 61.99,42.03 60.78,40.82 60.78,36.62 WLAN.TX
SCK1  (via drill 0.3 pad 0.61)  (2 unrouted)
  Top 0.305: 40.34,27.64 40.53,27.64 40.99,27.18 41.81,27.18 44.73,24.27 CC2.SCLK 44.21,22.12 44.71,22.12 45.85,20.97 46.55,20.97 48.72,18.8 51.12,18.8 54.44,22.13 67.09,22.13 68.41,23.45 | 40.34,27.64 | 40.34,27.64 39.79,27.64 39.34,28.1 39.15,28.1 39.08,28.16 36.87,28.16 35.67,26.96 35.67,24.08 31.99,20.4 26.53,20.4 24.56,22.37 23.38,22.37 CC0.SCLK 24.42,25.24 25.04,25.86 v25.04,26.7 | 68.41,23.45 69.8,22.07 86.58,22.07 88.01,23.5 CC1.SCLK | 66.55,27.86 66.66,27.86 68.41,26.11 68.41,23.45 | CC3.SCLK 63.24,26.04 65.07,27.86 66.55,27.86 | CC2-EXT.SCK 66.55,27.86
  Bottom 0.305: U$1.28 31.69,47.61 27.88,43.8 27.88,29.54 v25.04,26.7
SCK2
  Top 0.305: IC2.4 16.16,31.62 17.88,33.34 17.88,35.34 18.54,36.01 46.93,36.01 U$1.19
TX1
  Top 0.305: HMMOD-UART.6 93.54,35.33 93.08,34.87 82.5,34.87 80.54,36.83 55.17,36.83 UART1.2
  Bottom 0.305: UART1.2 51.51,36.83 50.56,37.78 50.56,50.58 49.91,51.23 49,51.23 48.2,50.43 48.2,48.38 47.42,47.61 44.39,47.61 U$1.23
TX-MAPLE
  Top 0.305: UART0.2 51.51,46.99 26.5,46.99 U$1.31
TX_DBG  (via drill 0.3 pad 0.61)
  Top 0.305: v37.63,38.3 56.29,38.3 57.02,39.03 65.36,39.03 66.34,38.05 WLAN.RX
  Bottom 0.305: U$1.15 36.77,37.44 v37.63,38.3 | DBG.3 80.96,45.72 AIR602.10 73.2,37.96 68.35,37.96 68.25,38.05 WLAN.RX
VCC  (via drill 0.3 pad 0.61)  (2 unrouted)
  Top 0.61: 31.94,23.66 C1.2 30.48,23.74 30.13,23.39 CC0.VCC | v35.05,24.39 32.67,24.39 31.94,23.66 | 31.94,23.66 | C7.2 v49.71,29.08 | 12.83,54.66 20.98,54.66 22.85,52.79 22.85,48.16 26.13,44.88 50.93,44.88 51.36,44.45 UART0.1 56.13,41.66 C12.1 83.63,38.8 83.54,38.7 HMMOD-UART.1 | v79.44,48.24 80.5,47.18 C2.2 93.79,47.18 DBG.2 | UART1.1 53.62,34.29 55.32,34.29 66.08,34.29 WLAN.VCC | 9.39,47.41 10.1,48.12 10.1,51.75 IC2.11 IC2.10 12.83,54.66 | 12.83,54.66 11.75,55.74 11.33,55.74 C6.1 | 9.39,47.41 3.21,47.41 U$1.40 | 9.39,47.41 9.99,46.81 9.99,37.09 9.54,36.64 3.67,36.64 U$1.1 | CC3.VCC 69.25,26.19 69.09,26.34 69.09,27.7 CC2-EXT.VCC@1 | CC1.VCC 94.01,26.19 83.67,26.19 C5.+
  Bottom 0.61: 51.03,24.39 51.03,18.52 51.18,18.36 VTRX2.1 | 51.03,29.08 51.03,24.39 | 51.03,24.39 v35.05,24.39 | 51.03,29.08 51.36,29.41 51.36,34.29 UART1.1 | 51.03,29.08 v49.71,29.08 | v79.44,48.24 78.98,47.79 77.85,47.79 AIR602.4 | DBG.2 88.01,43.18 83.54,38.7 HMMOD-UART.1 83.54,35.17 82.32,35.17 78.61,31.46 | C5.+ 78.61,31.46 | 78.61,31.46 70.31,31.46 CC2-EXT.VCC@0 | CC2-EXT.VCC@0 CC2-EXT.VCC@1 | CC2-EXT.VCC@0 69.09,33.71 WLAN.VCC 66.09,36.72 66.09,40.11 65.3,40.89 CHPD1.2
VIN
  Bottom 0.61: F1.P$2 12.62,21.97 11.84,21.18 U$2.TIP
VIN2
  Top 0.61: U$1.21 50.63,48.26 70.94,48.26 75.03,44.17 94.26,44.17 DBG.1
  Bottom 0.61: U$1.21 49.47,47.45 43.12,41.1 43.12,32.95 42.35,32.19 41.77,32.19 30.32,20.73 30.32,20.12 IC1.4 26.76,16.76 26.76,17.6 26.72,17.64 26.72,17.07 | 26.72,17.07 22.66,17.07 22.1,16.51 IC6.2 NO_REGULATOR.1 | IC6.TAB 26.72,17.07
WIZ_CS
  Top 0.305: IC2.5 17.91,29.06 22.38,29.06 25.67,32.35 49.47,32.35 U$1.20
WIZ_RST
  Bottom 0.305: IC2.8 17.91,54.51 33.93,54.51 38.25,50.19 38.25,37.07 39.31,36.01 U$1.16

### Text on the board
tNames: MAPLE CUN / - large - | GND | CS | VCC | GND | T | GND | R | R | VCC | T | + | GND | VIN | TX | TX | RX | RX | 31 | VCC | LAN | C7 | Ant3 | Ant1 | Ant2 | Ant4
bNames: U.FL | WLAN from Seeedstudio... | Socket CC1101 / TRX. 3 | Fuse | Version 3.4 / www.neuby.de | MAPLE CUN | Ant1 | Ant3 | Ant4 | Ant2
bDocu: cut Antenna here